# EAGLE schematic DS1307 (EAGLE 7.5.0)
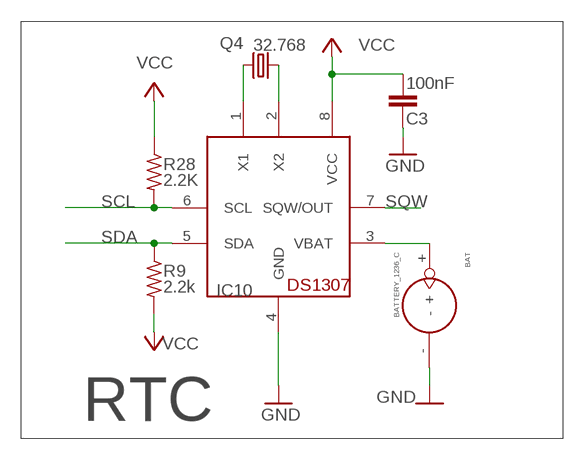
[diagram p0: schematic, sheet 1]

## Parts
BAT  BATTERY_1236_C  [BATTERY_1236_C]
C3  100nF  C-EU050-024X044  [C050-024X044]
IC10  DS1307  [DIL08]
Q4  32.768  CRYTALTC38H  [TC38H]
R9  2.2k  R-US_0204/7  [0204/7]
R28  2.2K  R-US_0204/7  [0204/7]

## Nets
GND: BAT.- C3.1 IC10.4(GND)
N$50: IC10.1(X1) Q4.2
N$51: IC10.2(X2) Q4.1
N$52: BAT.+ IC10.3(VBAT)
SCL: IC10.6(SCL) R28.2
SDA: IC10.5(SDA) R9.1
SQW: IC10.7(SQW/OUT)
VCC: C3.2 IC10.8(VCC) R9.2 R28.1

## Notes on the sheet
- RTC

## Library data of the parts
BAT = Itead_BP_110825.lbr:BATTERY_1236_C: SOC004
C3 = rcl:C-EU: CAPACITOR, European symbol
IC10 = adafruit:DS1307: DS1307 Real time clock (RTC) with battery backup ability. Talk to it via i2c
Q4 = crystal:CRYTAL: CRYSTAL
R9 R28 = adafruit:R-US_: RESISTOR, American symbol